# Altium schematic sheet DataVideoPort.SchDoc
size A4
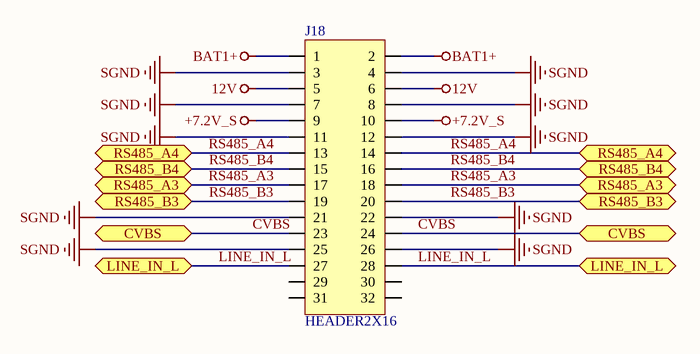
[diagram p0: DataVideoPort.SchDoc]

## Parts
J18  HEADER2X16  [HD2X16-2.00]

## Ports
CVBS (bidir), LINE_IN_L (bidir), RS485_A3 (bidir), RS485_A4 (bidir), RS485_B3 (bidir), RS485_B4 (bidir)

## Nets
12V: J18.5 J18.6
+7.2V_S: J18.9 J18.10
BAT1+: J18.1 J18.2
SGND: J18.3 J18.4 J18.7 J18.8 J18.11 J18.12 J18.21 J18.22 J18.25 J18.26
CVBS: J18.23 J18.24 ; port CVBS
LINE_IN_L: J18.27 J18.28 ; port LINE_IN_L
RS485_A3: J18.17 J18.18 ; port RS485_A3
RS485_A4: J18.13 J18.14 ; port RS485_A4
RS485_B3: J18.19 J18.20 ; port RS485_B3
RS485_B4: J18.15 J18.16 ; port RS485_B4

Not connected (* = marked no-connect by the designer): J18 29 30 31 32